# Altium schematic sheet Buck_Converter Sch.SchDoc
size A4
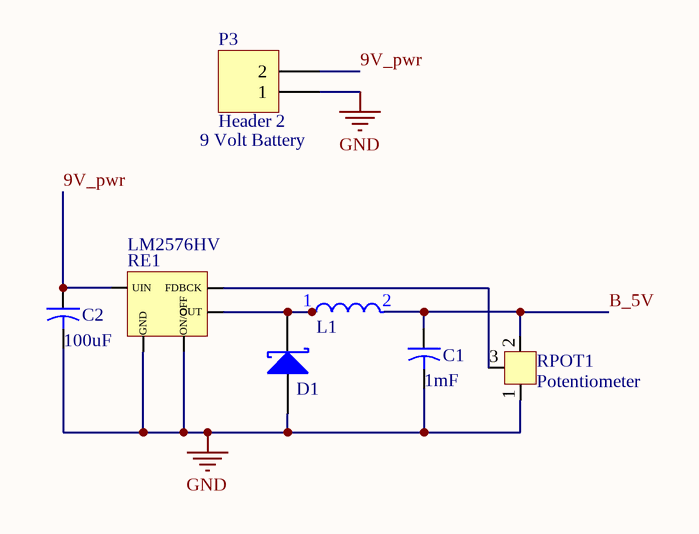
[diagram p0: Buck_Converter Sch.SchDoc]

## Parts
C1  value 1mF  [CAPR5-4X5]  (hidden comment: Cap2)
C2  value 100uF  [CAPR5-4X5]  (hidden comment: Cap2)
D1  Diode 11DQ03  [DO-204AL]  (value not drawn)
L1  Inductor SMD 100 uH  [Inductor 100uH]  (value not drawn)
P3  Header 2  [HDR1X2]
RE1  LM2576HV  [LM2576]
RPOT1  Potentiometer  [Potentiometer 10k]

## Nets
GND: C1.2 C2.2 D1.1(A) P3.1 RE1.3(GND) RE1.5(ON/OFF) RPOT1.1
9V_pwr: C2.1 P3.2 RE1.1(UIN)
B_5V: C1.1 L1.2 RPOT1.2
NetD1_2: D1.2(K) L1.1 RE1.2(OUT)
NetRE1_4: RE1.4(FDBCK) RPOT1.3

## Notes on the sheet
- (near P3) 9 Volt Battery

## Library data of the parts
C1 C2 = Cap2: Capacitor; Published: 23-Sep-2002; PackageReference: CAPR5-4X5; Publisher: Altium Limited; PackageDescription: Capacitor; 2 Leads
D1 = Diode 11DQ03: Schottky Rectifier; Published: 8-Jun-2000; LatestRevisionDate: 17-Jul-2002; LatestRevisionNote: Re-released for DXP Platform.; DatasheetVersion: Dec-1997; PackageReference: DO-204AL; Publisher: Altium Limited; PackageDescription: Diode, Axial; Body 5.2 x 2.7 mm (LxDia. max), Lead Dia. 0.86 mm (max); Code_JEDEC: DO-204-AL; ComponentLink1Description: Manufacturer Link; ComponentLink1URL: http://www.irf.com/; ComponentLink2Description: Datasheet; ComponentLink2URL: http://www.irf.com/product-info/datasheets/data/11dq03.pdf
P3 = Header 2: Header, 2-Pin; LatestRevisionDate: 17-Jul-2002; LatestRevisionNote: Re-released for DXP Platform.; Publisher: Altium Limited
RPOT1 = Potentiometer: potentiometer 10k